# Altium schematic sheet 2_MCU.SchDoc: Microcontroller
size A4; DrawnBy: Denis Cooper; Organization: felinefeast.org; Revision: 1.0; SheetNumber: 2; SheetTotal: 5
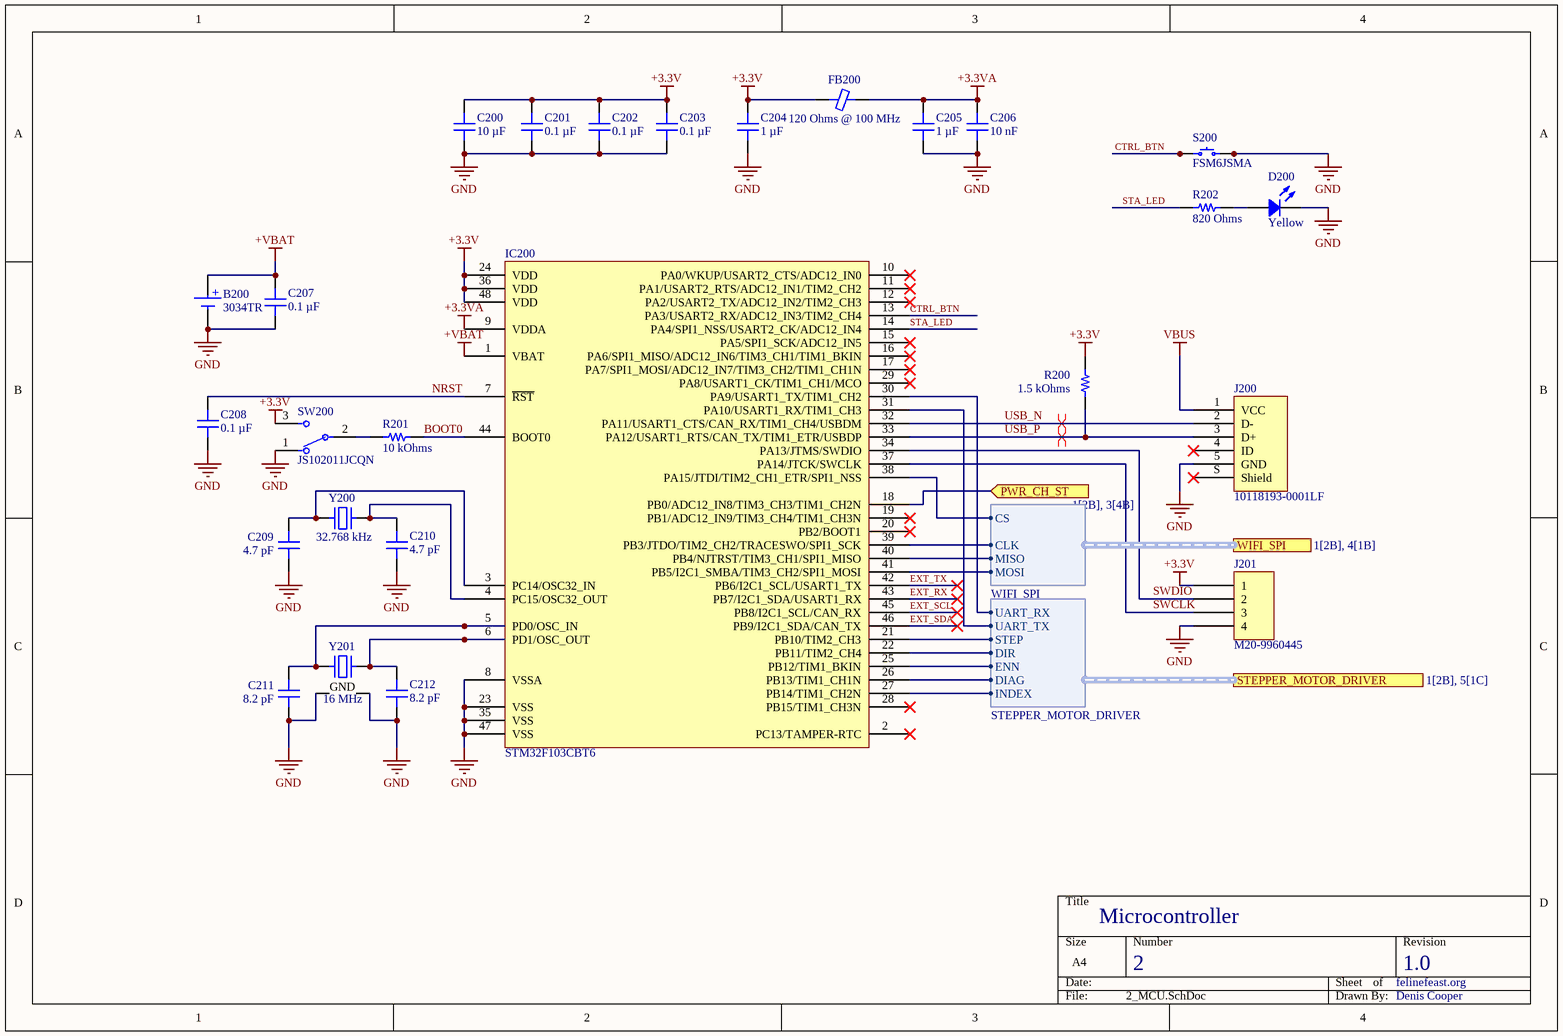
[diagram p0: 2_MCU.SchDoc]

## Parts
B200  3034TR  [KEYSTONE 3034TR]
C200  10 µF  [CAP 0805_2012]
C201  0.1 µF  [CAP 0603_1608]
C202  0.1 µF  [CAP 0603_1608]
C203  0.1 µF  [CAP 0603_1608]
C204  1 µF  [CAP 0805_2012]
C205  1 µF  [CAP 0805_2012]
C206  Capacitance: 10 nF  [CAP 0603_1608]  (hidden comment: 10000 pF)
C207  0.1 µF  [CAP 0603_1608]
C208  0.1 µF  [CAP 0603_1608]
C209  4.7 pF  [MURATA GJM155 0402_1005]
C210  4.7 pF  [MURATA GJM155 0402_1005]
C211  8.2 pF  [CAP 0603_1608]
C212  8.2 pF  [CAP 0603_1608]
D200  Yellow  [LED 0603_1608 YELLOW]
FB200  120 Ohms @ 100 MHz  [FER 0603_1608]
IC200  STM32F103CBT6  [ST LQFP-48 7X7MM]
J200  10118193-0001LF  [FCI USB 10118193-0001LF]
J201  M20-9960445  [HARWIN M20-9960445]
R200  1.5 kOhms  [RES 0603_1608]
R201  10 kOhms  [RES 0603_1608]
R202  820 Ohms  [RES 0603_1608]
S200  FSM6JSMA  [TE FSM6JSMA]
SW200  JS102011JCQN  [FP-JS102011JCQN-MFG]
Y200  32.768 kHz  [ABRACON ABS07]
Y201  16 MHz  [NDK NX3225GA]

## Ports
PWR_CH_ST (in, see 1[2B], 3[4B]), STEPPER_MOTOR_DRIVER (harness STEPPER_MOTOR_DRIVER, see 1[2B], 5[1C]), WIFI_SPI (harness WIFI_SPI, see 1[2B], 4[1B])

## Harnesses
WIFI_SPI: CLK, CS, MOSI, MISO
STEPPER_MOTOR_DRIVER: STEP, DIR, UART_TX, ENN, INDEX, DIAG, UART_RX

## Nets
+3.3V: C200.1 C201.2 C202.2 C203.2 C204.2 FB200.1 IC200.24(VDD) IC200.36(VDD) IC200.48(VDD) J201.1 R200.2 SW200.3
+3.3VA: C205.2 C206.2 FB200.2 IC200.9(VDDA)
+VBAT: B200.1(+) C207.2 IC200.1(VBAT)
GND: B200.2(-) C200.2 C201.1 C202.1 C203.1 C204.1 C205.1 C206.1 C207.1 C208.2 C209.1 C210.1 C211.2 C212.2 D200.2 IC200.8(VSSA) IC200.23(VSS) IC200.35(VSS) IC200.47(VSS) J200.5(GND) J201.4 S200.3 S200.4 SW200.1 Y201.2(GND) Y201.4(GND)
VBUS: J200.1(VCC)
BOOT0: IC200.44(BOOT0) R201.2
CTRL_BTN: IC200.13(PA3/USART2_RX/ADC12_IN3/TIM2_CH4) S200.1 S200.2
EXT_RX: IC200.43(PB7/I2C1_SDA/USART1_RX)
EXT_SCL: IC200.45(PB8/I2C1_SCL/CAN_RX)
EXT_SDA: IC200.46(PB9/I2C1_SDA/CAN_TX)
EXT_TX: IC200.42(PB6/I2C1_SCL/USART1_TX)
NRST: C208.1 IC200.7(~{RST})
PWR_CH_ST: IC200.18(PB0/ADC12_IN8/TIM3_CH3/TIM1_CH2N) ; port PWR_CH_ST
STA_LED: IC200.14(PA4/SPI1_NSS/USART2_CK/ADC12_IN4) R202.2
SWCLK: IC200.37(PA14/JTCK/SWCLK) J201.3
SWDIO: IC200.34(PA13/JTMS/SWDIO) J201.2
USB_N: IC200.32(PA11/USART1_CTS/CAN_RX/TIM1_CH4/USBDM) J200.2(D-)
USB_P: IC200.33(PA12/USART1_RTS/CAN_TX/TIM1_ETR/USBDP) J200.3(D+) R200.1
NetC209_2: C209.2 IC200.3(PC14/OSC32_IN) Y200.1
NetC210_2: C210.2 IC200.4(PC15/OSC32_OUT) Y200.2
NetC211_1: C211.1 IC200.5(PD0/OSC_IN) Y201.1
NetC212_1: C212.1 IC200.6(PD1/OSC_OUT) Y201.3
NetD200_1: D200.1 R202.1
NetIC200_21: IC200.21(PB10/TIM2_CH3) ; port STEPPER_MOTOR_DRIVER.STEP
NetIC200_22: IC200.22(PB11/TIM2_CH4) ; port STEPPER_MOTOR_DRIVER.DIR
NetIC200_25: IC200.25(PB12/TIM1_BKIN) ; port STEPPER_MOTOR_DRIVER.ENN
NetIC200_26: IC200.26(PB13/TIM1_CH1N) ; port STEPPER_MOTOR_DRIVER.DIAG
NetIC200_27: IC200.27(PB14/TIM1_CH2N) ; port STEPPER_MOTOR_DRIVER.INDEX
NetIC200_30: IC200.30(PA9/USART1_TX/TIM1_CH2) ; port STEPPER_MOTOR_DRIVER.UART_RX
NetIC200_31: IC200.31(PA10/USART1_RX/TIM1_CH3) ; port STEPPER_MOTOR_DRIVER.UART_TX
NetIC200_38: IC200.38(PA15/JTDI/TIM2_CH1_ETR/SPI1_NSS) ; port WIFI_SPI.CS
NetIC200_39: IC200.39(PB3/JTDO/TIM2_CH2/TRACESWO/SPI1_SCK) ; port WIFI_SPI.CLK
NetIC200_40: IC200.40(PB4/NJTRST/TIM3_CH1/SPI1_MISO) ; port WIFI_SPI.MISO
NetIC200_41: IC200.41(PB5/I2C1_SMBA/TIM3_CH2/SPI1_MOSI) ; port WIFI_SPI.MOSI
NetR201_1: R201.1 SW200.2

Not connected (* = marked no-connect by the designer): IC200 2(PC13/TAMPER-RTC)* 10(PA0/WKUP/USART2_CTS/ADC12_IN0)* 11(PA1/USART2_RTS/ADC12_IN1/TIM2_CH2)* 12(PA2/USART2_TX/ADC12_IN2/TIM2_CH3)* 15(PA5/SPI1_SCK/ADC12_IN5)* 16(PA6/SPI1_MISO/ADC12_IN6/TIM3_CH1/TIM1_BKIN)* 17(PA7/SPI1_MOSI/ADC12_IN7/TIM3_CH2/TIM1_CH1N)* 19(PB1/ADC12_IN9/TIM3_CH4/TIM1_CH3N)* 20(PB2/BOOT1)* 28(PB15/TIM1_CH3N)* 29(PA8/USART1_CK/TIM1_CH1/MCO)*; J200 4(ID)* S(Shield)*

## Layout directives
differential pair: USB_N, USB_P

## Library data of the parts
B200 = 3034TR: BATTERY RETAINER COIN 20MM SMD; Manufacturer: Keystone Electronics; Battery Cell Size: Coin, 20.0mm; Battery Series: 2020, 2025, 2032; Battery Type, Function: Coin Cell, Retainer; Number of Cells: 1; Part Number: 3034TR; ComponentLink1Description: Datasheet; ComponentLink1URL: http://keyelco.com/userAssets/file/M65p9.pdf; ComponentLink2Description: DigiKey Link; ComponentLink2URL: https://www.digikey.com/en/products/detail/keystone-electronics/3034TR/4499408; Height Above Board: 0.160" (4.06mm); LastUpdated: 29.08.2025 3:23:39; Lifecycle Status: Active; Minimum Order: 1; Mounting Type: PCB, Surface Mount; Packaging: TapeAndReel; PartId: 8; Part Status: Active; Price: 0.20; Series: -; Style: Retainer; Supplier 1: DigiKey; Supplier Part Number 1: 36-3034CT-ND; Termination Style: SMD (SMT) Tab
C200 = CL21B106KPQNNNE: CAP CER 10UF 10V X7R 0805; manufacturer: Samsung Electro-Mechanics; Tolerance: ±10%; Part Number: CL21B106KPQNNNE; Capacitance: 10 µF; Applications: General Purpose; componentlink1description: Datasheet; componentlink1url: http://www.samsungsem.com/kr/support/product-search/mlcc/CL21B106KPQNNNE.jsp; componentlink2description: DigiKey Link; componentlink2url: https://www.digikey.com/en/products/detail/samsung-electro-mechanics/CL21B106KPQNNNE/3887422; Device Package: 0805 (2012 Metric); lastupdated: 09.02.2024 20:15:41; Lifecycle Status: Active; Minimum Order: 1; Mounting Type: Surface Mount, MLCC; Operating Temperature: -55°C ~ 125°C; Package / Case: 0805 (2012 Metric); packaging: TapeAndReel; partid: 13130; Part Status: Active; price: 0.02; series: CL; Size / Dimension: 0.079" L x 0.049" W (2.00mm x 1.25mm); Supplier 1: DigiKey; Supplier Part Number 1: 1276-1764-1-ND; Temperature Coefficient: X7R; Thickness (Max): 0.055" (1.40mm); value: 10 µF; Voltage - Rated: 10V
C201-C203 C207 C208 = CL10B104KA8NNNC: CAP CER 0.1UF 25V X7R 0603; manufacturer: Samsung Electro-Mechanics; Tolerance: ±10%; Part Number: CL10B104KA8NNNC; Capacitance: 0.1 µF; Applications: General Purpose; componentlink1description: Datasheet; componentlink1url: http://www.samsungsem.com/kr/support/product-search/mlcc/CL10B104KA8NNNC.jsp; componentlink2description: DigiKey Link; componentlink2url: https://www.digikey.com/en/products/detail/samsung-electro-mechanics/CL10B104KA8NNNC/3886664; Device Package: 0603 (1608 Metric); lastupdated: 09.02.2024 20:10:20; Lifecycle Status: Active; Minimum Order: 1; Mounting Type: Surface Mount, MLCC; Operating Temperature: -55°C ~ 125°C; Package / Case: 0603 (1608 Metric); packaging: TapeAndReel; partid: 9793; Part Status: Active; price: 0.01; series: CL; Size / Dimension: 0.063" L x 0.031" W (1.60mm x 0.80mm); Supplier 1: DigiKey; Supplier Part Number 1: 1276-1006-1-ND; Temperature Coefficient: X7R; Thickness (Max): 0.035" (0.90mm); value: 0.1 µF; Voltage - Rated: 25V
C204 C205 = CL21B105KAFNFNE: CAP CER 1UF 25V X7R 0805; manufacturer: Samsung Electro-Mechanics; Tolerance: ±10%; Part Number: CL21B105KAFNFNE; Capacitance: 1 µF; Applications: General Purpose; componentlink1description: Datasheet; componentlink1url: http://www.samsungsem.com/kr/support/product-search/mlcc/CL21B105KAFNFNE.jsp; componentlink2description: DigiKey Link; componentlink2url: https://www.digikey.com/en/products/detail/samsung-electro-mechanics/CL21B105KAFNFNE/3888584; Device Package: 0805 (2012 Metric); lastupdated: 09.02.2024 20:16:02; Lifecycle Status: Active; Minimum Order: 1; Mounting Type: Surface Mount, MLCC; Operating Temperature: -55°C ~ 125°C; Package / Case: 0805 (2012 Metric); packaging: TapeAndReel; partid: 4875; Part Status: Active; price: 0.01; series: CL; Size / Dimension: 0.079" L x 0.049" W (2.00mm x 1.25mm); Supplier 1: DigiKey; Supplier Part Number 1: 1276-2926-1-ND; Temperature Coefficient: X7R; Thickness (Max): 0.053" (1.35mm); value: 1 µF; Voltage - Rated: 25V
C206 = CL10B103KB8NNNC: CAP CER 10000PF 50V X7R 0603; manufacturer: Samsung Electro-Mechanics; Tolerance: ±10%; Part Number: CL10B103KB8NNNC; Applications: General Purpose; componentlink1description: Datasheet; componentlink1url: http://www.samsungsem.com/kr/support/product-search/mlcc/CL10B103KB8NNNC.jsp; componentlink2description: DigiKey Link; componentlink2url: https://www.digikey.com/en/products/detail/samsung-electro-mechanics/CL10B103KB8NNNC/3886667; Device Package: 0603 (1608 Metric); lastupdated: 09.02.2024 20:10:26; Lifecycle Status: Active; Minimum Order: 1; Mounting Type: Surface Mount, MLCC; Operating Temperature: -55°C ~ 125°C; Package / Case: 0603 (1608 Metric); packaging: TapeAndReel; partid: 5498; Part Status: Active; price: 0.01; series: CL; Size / Dimension: 0.063" L x 0.031" W (1.60mm x 0.80mm); Supplier 1: DigiKey; Supplier Part Number 1: 1276-1009-1-ND; Temperature Coefficient: X7R; Thickness (Max): 0.035" (0.90mm); value: 10000 pF; Voltage - Rated: 50V
C209 C210 = GJM1555C1H4R7GB01D: CAP CER 4.7PF 50V C0G/NP0 0402; manufacturer: Murata Electronics; Temperature Coefficient: C0G, NP0; Tolerance: ±2%; Part Number: GJM1555C1H4R7GB01D; Capacitance: 4.7 pF; Applications: RF, Microwave, High Frequency; componentlink1description: Datasheet; componentlink1url: https://search.murata.co.jp/Ceramy/image/img/A01X/G101/ENG/GJM1555C1H4R7GB01-01A.pdf; componentlink2description: DigiKey Link; componentlink2url: https://www.digikey.com/en/products/detail/murata-electronics/GJM1555C1H4R7GB01D/16033620; Device Package: 0402 (1005 Metric); Features: High Q, Low Loss; lastupdated: 20.07.2024 0:08:42; Lifecycle Status: Active; Minimum Order: 1; Mounting Type: Surface Mount, MLCC; Operating Temperature: -55°C ~ 125°C; Package / Case: 0402 (1005 Metric); packaging: TapeAndReel; partid: 55648; price: 0.01; series: GJM; Size / Dimension: 0.039" L x 0.020" W (1.00mm x 0.50mm); Supplier 1: DigiKey; Supplier Part Number 1: 490-GJM1555C1H4R7GB01DCT-ND; Thickness (Max): 0.022" (0.55mm); value: 4.7 pF; Voltage - Rated: 50V
C211 C212 = CC0603JRNPO9BN8R2: CAP CER 8.2PF 50V C0G/NPO 0603; manufacturer: Yageo; Temperature Coefficient: C0G, NP0; Tolerance: ±5%; Part Number: CC0603JRNPO9BN8R2; Capacitance: 8.2 pF; Applications: General Purpose; componentlink1description: Datasheet; componentlink1url: https://www.yageo.com/upload/media/product/productsearch/datasheet/mlcc/UPY-GP_NP0_16V-to-50V_17.pdf; componentlink2description: DigiKey Link; componentlink2url: https://www.digikey.com/en/products/detail/yageo/CC0603JRNPO9BN8R2/5883626; Device Package: 0603 (1608 Metric); lastupdated: 09.02.2024 20:10:11; Lifecycle Status: Active; Minimum Order: 1; Mounting Type: Surface Mount, MLCC; Operating Temperature: -55°C ~ 125°C; Package / Case: 0603 (1608 Metric); packaging: TapeAndReel; partid: 15511; Part Status: Active; price: 0.01; series: CC; Size / Dimension: 0.063" L x 0.031" W (1.60mm x 0.80mm); Supplier 1: DigiKey; Supplier Part Number 1: 311-3977-1-ND; Thickness (Max): 0.035" (0.90mm); value: 8.2 pF; Voltage - Rated: 50V
D200 = LY L29K-H1K2-26-Z: LED YELLOW DIFFUSED 0603 SMD; Manufacturer: OSRAM Opto Semiconductors Inc.; Configuration: Standard; Current - Test: 2mA; Lens Color: White; Lens Size: 1.30mm x 0.80mm; Lens Style: Rectangle with Flat Top; Millicandela Rating: 7mcd; Viewing Angle: 160°; Voltage - Forward (Vf) (Typ): 1.8V; Wavelength - Dominant: 587nm; Wavelength - Peak: 591nm; Part Number: LY L29K-H1K2-26-Z; Color: Yellow; ComponentLink1Description: Datasheet; ComponentLink1URL: https://dammedia.osram.info/media/resource/hires/osram-dam-2492957/LY%20L29K.pdf; ComponentLink2Description: DigiKey Link; ComponentLink2URL: https://www.digikey.com/en/products/detail/osram-opto-semiconductors-inc/LY-L29K-H1K2-26-Z/810340; Device Package: 0603 (1608 Metric); Height (Max): 0.65mm; LastUpdated: 03.06.2024 20:01:09; Lens Transparency: Diffused; Lifecycle Status: Active; Minimum Order: 1; Mounting Type: Surface Mount; Package / Case: 0603 (1608 Metric); Packaging: TapeAndReel; PartId: 140; Part Status: Active; Price: 0.07; Series: SMARTLED® 0603; Size / Dimension: 1.70mm L x 0.80mm W; Supplier 1: DigiKey; Supplier Part Number 1: 475-1196-1-ND; Supplier Device Package: 0603; Value: Yellow
FB200 = GZ1608D121TF: FERRITE BEAD 120 OHM 0603 1LN; Manufacturer: Shenzhen Sunlord Electronics Co., Ltd.; Current Rating (Max): 300mA; DC Resistance (DCR) (Max): 200mOhm; Filter Type: Signal Line; Number of Lines: 1; Part Number: GZ1608D121TF; ComponentLink1Description: Datasheet; ComponentLink1URL: https://www.sunlordinc.com/Download.aspx?file=L1VwbG9hZEZpbGVzL1BERl9DYXQvMjAxOTA0MDgxMzU0MTk3NjMucGRm&lan=en; ComponentLink2Description: DigiKey Link; ComponentLink2URL: https://www.digikey.com/en/products/detail/shenzhen-sunlord-electronics-co-ltd/GZ1608D121TF/14120576; Device Package: 0603 (1608 Metric); Height (Max): 0.037" (0.95mm); Impedance @ Frequency: 120 Ohms @ 100 MHz; LastUpdated: 03.06.2024 19:51:45; Lifecycle Status: Active; Minimum Order: 1; Mounting Type: Surface Mount; Operating Temperature: -55°C ~ 125°C; Package / Case: 0603 (1608 Metric); Packaging: TapeAndReel; PartId: 2588; Part Status: Active; Price: 0.01; Series: GZ; Size / Dimension: 0.063" L x 0.031" W (1.60mm x 0.80mm); Supplier 1: DigiKey; Supplier Part Number 1: 3442-GZ1608D121TFCT-ND; Value: 120 Ohms @ 100 MHz
IC200 = STM32F103CBT6: IC MCU 32BIT 128KB FLASH 48LQFP; Manufacturer: STMicroelectronics; Connectivity: CANbus, I²C, IrDA, LINbus, SPI, UART/USART, USB; Core Processor: ARM® Cortex®-M3; Core Size: 32-Bit; Data Converters: A/D 10x12b; Number of I/O: 37; Oscillator Type: Internal; Peripherals: DMA, Motor Control PWM, PDR, POR, PVD, PWM, Temp Sensor, WDT; Program Memory Size: 128KB (128K x 8); RAM Size: 20K x 8; Speed: 72MHz; Voltage - Supply (Vcc/Vdd): 2V ~ 3.6V; Part Number: STM32F103CBT6; ComponentLink1Description: Datasheet; ComponentLink1URL: https://www.st.com/resource/en/datasheet/stm32f103cb.pdf; ComponentLink2Description: DigiKey Link; ComponentLink2URL: http://digikey.com/product-detail/en/stmicroelectronics/STM32F103CBT6/497-6288-ND/1754420; Device Package: 48-LQFP; LastUpdated: 24.05.2020 22:49:18; Lifecycle Status: Active; Minimum Order: 1; Mounting Type: Surface Mount; Operating Temperature: -40°C ~ 85°C (TA); Package / Case: 48-LQFP; Packaging: Tray; PartId: 194; Part Status: Active; Price: 5.25; Program Memory Type: FLASH; Series: STM32F1; Supplier 1: DigiKey; Supplier Part Number 1: 497-6288-ND
J200 = 10118193-0001LF: CONN RCPT USB2.0 MICRO B SMD R/A; Manufacturer: Amphenol ICC (FCI); Connector Type: USB - micro B; Current Rating (Amps): 1.8A per Contact; Gender: Receptacle; Mating Cycles: 10000; Number of Contacts: 5; Number of Ports: 1; Shielding: Shielded; Voltage - Rated: 100VAC; Part Number: 10118193-0001LF; ComponentLink1Description: Datasheet; ComponentLink1URL: https://cdn.amphenol-icc.com/media/wysiwyg/files/documentation/datasheet/inputoutput/io_usb_micro.pdf; ComponentLink2Description: DigiKey Link; ComponentLink2URL: //digikey.com/product-detail/en/amphenol-icc-fci/10118193-0001LF/609-4616-2-ND/2785388; Features: Solder Retention; LastUpdated: 09.12.2019 20:51:28; Lifecycle Status: 0; Minimum Order: 1; Mounting Feature: Horizontal; Mounting Type: Surface Mount, Right Angle; Through Hole; Operating Temperature: -30°C ~ 80°C; Packaging: TapeAndReel; Part Status: Active; Price: 0.21; Series: -; Specifications: USB 2.0; Supplier 1: DigiKey; Supplier Part Number 1: 609-4616-2-ND; Termination: Solder
J201 = M20-9960445: CONN HEADER R/A 4POS 2.54MM; Manufacturer: Harwin Inc.; Connector Type: Header, Cuttable; Contact Length - Mating: 0.240" (6.10mm); Contact Length - Post: 0.118" (3.00mm); Current Rating (Amps): 3A per Contact; Material Flammability Rating: UL94 V-0; Number of Positions: 4; Number of Positions Loaded: All; Pitch - Mating: 0.100" (2.54mm); Row Spacing - Mating: -40°C ~ 105°C; Shrouding: Unshrouded; Style: Board to Board or Cable; Part Number: M20-9960445; ComponentLink1Description: Datasheet; ComponentLink1URL: https://cdn.harwin.com/pdfs/Harwin_PC_Connectors_M20.pdf; ComponentLink2Description: DigiKey Link; ComponentLink2URL: https://www.digikey.com/en/products/detail/harwin-inc/M20-9960445/3921052; Contact Finish - Mating: Gold; Contact Material: Brass; Contact Shape: Square; Contact Type: Male Pin; Fastening Type: Push-Pull; Insulation Color: Black; Insulation Height: 0.100" (2.54mm); Insulation Material: Polyamide (PA6T), Nylon 6T; LastUpdated: 21.09.2022 19:23:20; Lifecycle Status: Active; Minimum Order: 1; Mounting Type: Through Hole, Right Angle; Number of Rows: 1; Operating Temperature: -40°C ~ 105°C; Packaging: Bulk; PartId: 167; Part Status: Active; Price: 0.11; Series: M20; Supplier 1: DigiKey; Supplier Part Number 1: 952-3286-ND; Termination: Solder
R200 = ERJ-3GEYJ152V: RES SMD 1.5K OHM 5% 1/10W 0603; Manufacturer: Panasonic Electronic Components; Power (Watts): 0.1W, 1/10W; Temperature Coefficient: ±200ppm/°C; Part Number: ERJ-3GEYJ152V; Value: 1.5 kOhms; ComponentLink1Description: Datasheet; ComponentLink1URL: http://industrial.panasonic.com/www-cgi/jvcr13pz.cgi?E+PZ+3+AOA0001+ERJ3GEYJ152V+7+WW; ComponentLink2Description: DigiKey Link; ComponentLink2URL: https://www.digikey.com/en/products/detail/panasonic-electronic-components/ERJ-3GEYJ152V/104381; Composition: Thick Film; Device Package: 0603 (1608 Metric); Features: Automotive AEC-Q200; Height - Seated (Max): 0.022" (0.55mm); LastUpdated: 09.02.2024 20:42:41; Lifecycle Status: Active; Minimum Order: 1; Number of Terminations: 2; Operating Temperature: -55°C ~ 155°C; Package / Case: 0603 (1608 Metric); Packaging: TapeAndReel; PartId: 19210; Part Status: Active; Price: 0.01; Ratings: AEC-Q200; Resistance: 1.5 kOhms; Series: ERJ-3G; Size / Dimension: 0.063" L x 0.031" W (1.60mm x 0.80mm); Supplier 1: DigiKey; Supplier Part Number 1: P1.5KGCT-ND; Supplier Device Package: 0603; Tolerance: ±5%
R201 = ERJ-P03F1002V: RES SMD 10 KOHM 1% 1/5W 0603; Manufacturer: Panasonic Electronic Components; Power (Watts): 0.2W, 1/5W; Temperature Coefficient: ±200ppm/°C; Part Number: ERJ-P03F1002V; Value: 10 kOhms; ComponentLink1Description: Datasheet; ComponentLink1URL: https://industrial.panasonic.com/cdbs/www-data/pdf/RDO0000/AOA0000C331.pdf; ComponentLink2Description: DigiKey Link; ComponentLink2URL: https://www.digikey.com/en/products/detail/panasonic-electronic-components/ERJ-P03F1002V/9810215; Composition: Thick Film; Device Package: 0603 (1608 Metric); Features: Automotive AEC-Q200, Pulse Withstanding; Height - Seated (Max): 0.022" (0.55mm); LastUpdated: 09.02.2024 20:40:33; Lifecycle Status: Active; Minimum Order: 1; Number of Terminations: 2; Operating Temperature: -55°C ~ 155°C; Package / Case: 0603 (1608 Metric); Packaging: TapeAndReel; PartId: 82212; Price: 0.03; Ratings: AEC-Q200; Resistance: 10 kOhms; Series: ERJ-P03; Size / Dimension: 0.063" L x 0.031" W (1.60mm x 0.80mm); Supplier 1: DigiKey; Supplier Part Number 1: 10-ERJ-P03F1002VCT-ND; Supplier Device Package: 0603; Tolerance: ±1%
R202 = ERJ-3EKF8200V: RES SMD 820 OHM 1% 1/10W 0603; Manufacturer: Panasonic Electronic Components; Power (Watts): 0.1W, 1/10W; Temperature Coefficient: ±100ppm/°C; Part Number: ERJ-3EKF8200V; Value: 820 Ohms; ComponentLink1Description: Datasheet; ComponentLink1URL: https://industrial.panasonic.com/cdbs/www-data/pdf/RDA0000/AOA0000C304.pdf; ComponentLink2Description: DigiKey Link; ComponentLink2URL: https://www.digikey.com/en/products/detail/panasonic-electronic-components/ERJ-3EKF8200V/1746447; Composition: Thick Film; Device Package: 0603 (1608 Metric); Features: Automotive AEC-Q200; Height - Seated (Max): 0.022" (0.55mm); LastUpdated: 09.02.2024 20:41:57; Lifecycle Status: Active; Minimum Order: 1; Number of Terminations: 2; Operating Temperature: -55°C ~ 155°C; Package / Case: 0603 (1608 Metric); Packaging: TapeAndReel; PartId: 25993; Part Status: Active; Price: 0.01; Ratings: AEC-Q200; Resistance: 820 Ohms; Series: ERJ-3EK; Size / Dimension: 0.063" L x 0.031" W (1.60mm x 0.80mm); Supplier 1: DigiKey; Supplier Part Number 1: P820HCT-ND; Supplier Device Package: 0603; Tolerance: ±1%
S200 = FSM6JSMA: SWITCH TACTILE SPST-NO 0.05A 24V; Manufacturer: TE Connectivity ALCOSWITCH Switches; Actuator Height off PCB, Vertical: 7.00mm; Actuator Orientation: Top Actuated; Actuator Type: Standard; Contact Rating @ Voltage: 0.05A @ 24VDC; Illumination: Non-Illuminated; Operating Force: 160gf; Outline: 6.00mm x 6.00mm; Switch Function: Off-Mom; Part Number: FSM6JSMA; Circuit: SPST-NO; ComponentLink1Description: Datasheet; ComponentLink1URL: https://www.te.com/commerce/DocumentDelivery/DDEController?Action=srchrtrv&DocNm=1308111-1_SWITCHES_CORE_PROGRAM_CATALOG&DocType=CS&DocLang=English; ComponentLink2Description: DigiKey Link; ComponentLink2URL: https://www.digikey.com/en/products/detail/te-connectivity-alcoswitch-switches/FSM6JSMA/525822; LastUpdated: 03.06.2024 20:19:31; Lifecycle Status: Active; Minimum Order: 1; Mounting Type: Surface Mount; Operating Temperature: -35°C ~ 85°C; Packaging: Bulk; Part Status: Active; Price: 0.17; Series: FSMJSMA; Supplier 1: DigiKey; Supplier Part Number 1: 450-1133-ND; Termination Style: Gull Wing
SW200 = CMP-10038-000010-1: SWITCH SLIDE SPDT 300MA 6V; Electrical Life: 5000Cycles; Switch Function: On-On; Actuator Material: Nylon; Actuator Length: 2mm; Actuator Type: Standard; Current Rating: 300mA; Voltage Rating (DC): 6V; Min Operating Temperature: -40°C; Throw Configuration: SPDT; Mount: Surface Mount; Switch Travel: 2mm; Max Operating Temperature: 85°C; Packaging: Cut Tape; Contact Plating: Silver; Contact Material: Copper Alloy
Y200 = ABS07-166-32.768KHZ-T: CRYSTAL 32.7680KHZ 7PF SMD; Manufacturer: Abracon LLC; ESR (Equivalent Series Resistance): 70 kOhms; Frequency Tolerance: ±10ppm; Operating Mode: Fundamental; Part Number: ABS07-166-32.768KHZ-T; ComponentLink1Description: Datasheet; ComponentLink1URL: https://abracon.com/datasheets/ABS07-166-32.768kHz-T.pdf; ComponentLink2Description: DigiKey Link; ComponentLink2URL: https://www.digikey.com/en/products/detail/abracon-llc/ABS07-166-32-768KHZ-T/8827199; Frequency: 32.768 kHz; Height - Seated (Max): 0.035" (0.90mm); LastUpdated: 03.06.2024 20:02:04; Lifecycle Status: Active; Load Capacitance: 7pF; Minimum Order: 1; Mounting Type: Surface Mount; Operating Temperature: -40°C ~ 85°C; Package / Case: 2-SMD, No Lead; Packaging: TapeAndReel; PartId: 384; Part Status: Active; Price: 0.38; Series: ABS07; Size / Dimension: 0.126" L x 0.059" W (3.20mm x 1.50mm); Supplier 1: DigiKey; Supplier Part Number 1: 535-14514-1-ND; Type: kHz Crystal (Tuning Fork); Value: 32.768 kHz
Y201 = NX3225GA-16.000M-STD-CRG-2: CRYSTAL 16.0000MHZ 8PF SMD; Manufacturer: NDK America, Inc.; ESR (Equivalent Series Resistance): 80 Ohms; Frequency Stability: ±30ppm; Frequency Tolerance: ±20ppm; Operating Mode: Fundamental; Part Number: NX3225GA-16.000M-STD-CRG-2; ComponentLink1Description: Datasheet; ComponentLink1URL: http://www.ndk.com/images/products/catalog/c_NX3225GA-STD-CRG-2_e.pdf; ComponentLink2Description: DigiKey Link; ComponentLink2URL: https://www.digikey.com/en/products/detail/ndk-america-inc/NX3225GA-16-000M-STD-CRG-2/3125634; Frequency: 16 MHz; Height - Seated (Max): 0.035" (0.90mm); LastUpdated: 03.06.2024 20:02:19; Lifecycle Status: Active; Load Capacitance: 8pF; Minimum Order: 1; Mounting Type: Surface Mount; Operating Temperature: -40°C ~ 85°C; Package / Case: 4-SMD, No Lead; Packaging: TapeAndReel; PartId: 549; Part Status: Active; Price: 0.33; Series: NX3225GA; Size / Dimension: 0.126" L x 0.098" W (3.20mm x 2.50mm); Supplier 1: DigiKey; Supplier Part Number 1: 644-1175-1-ND; Type: MHz Crystal; Value: 16 MHz